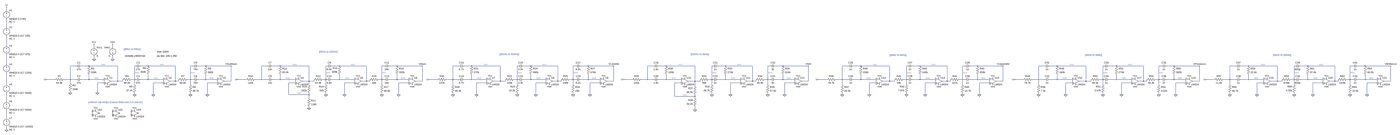
[diagram p0: schematic Combined.asc, whole sheet]
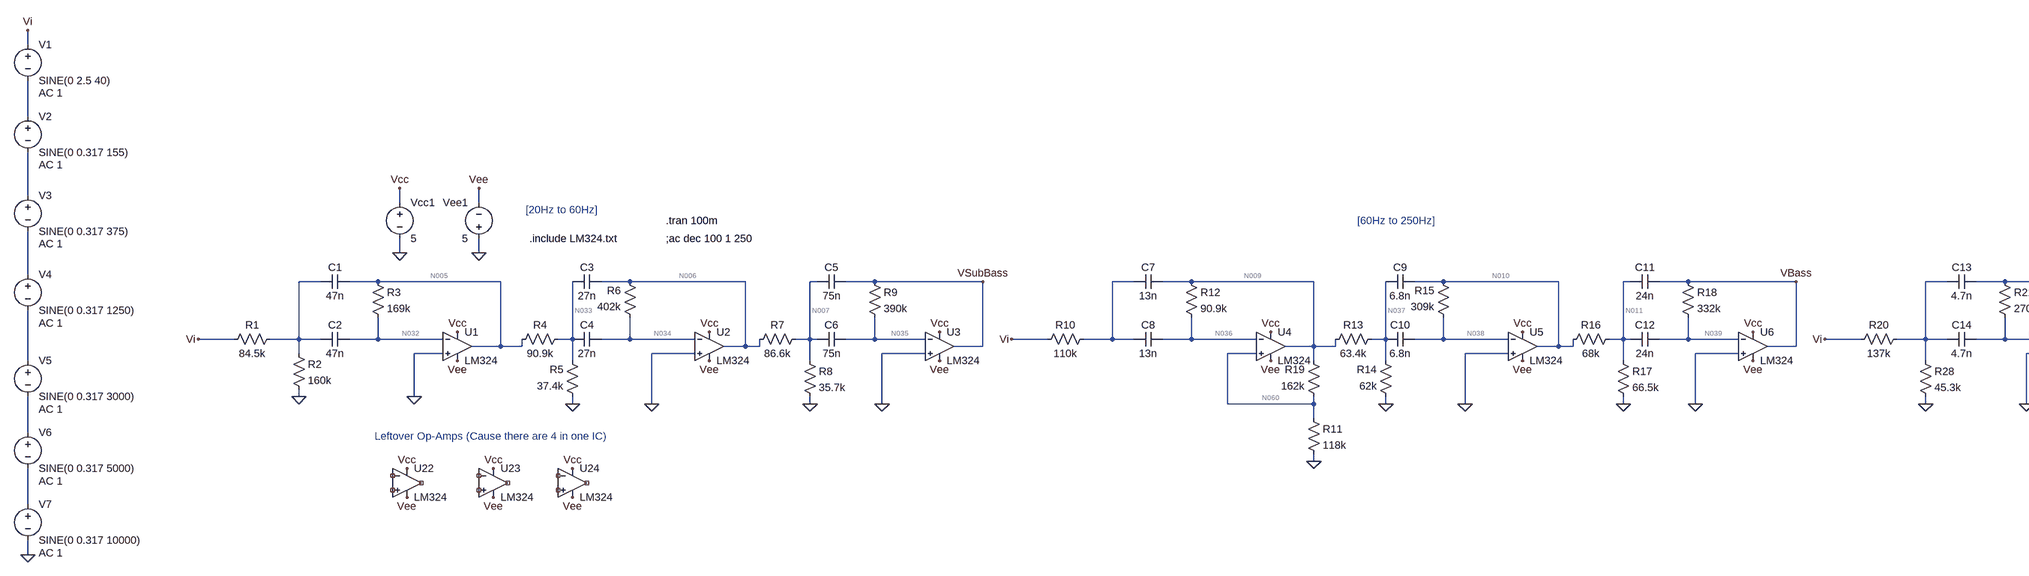
[diagram p1: schematic Combined.asc, part, row 1 of 1, column 1 of 3]
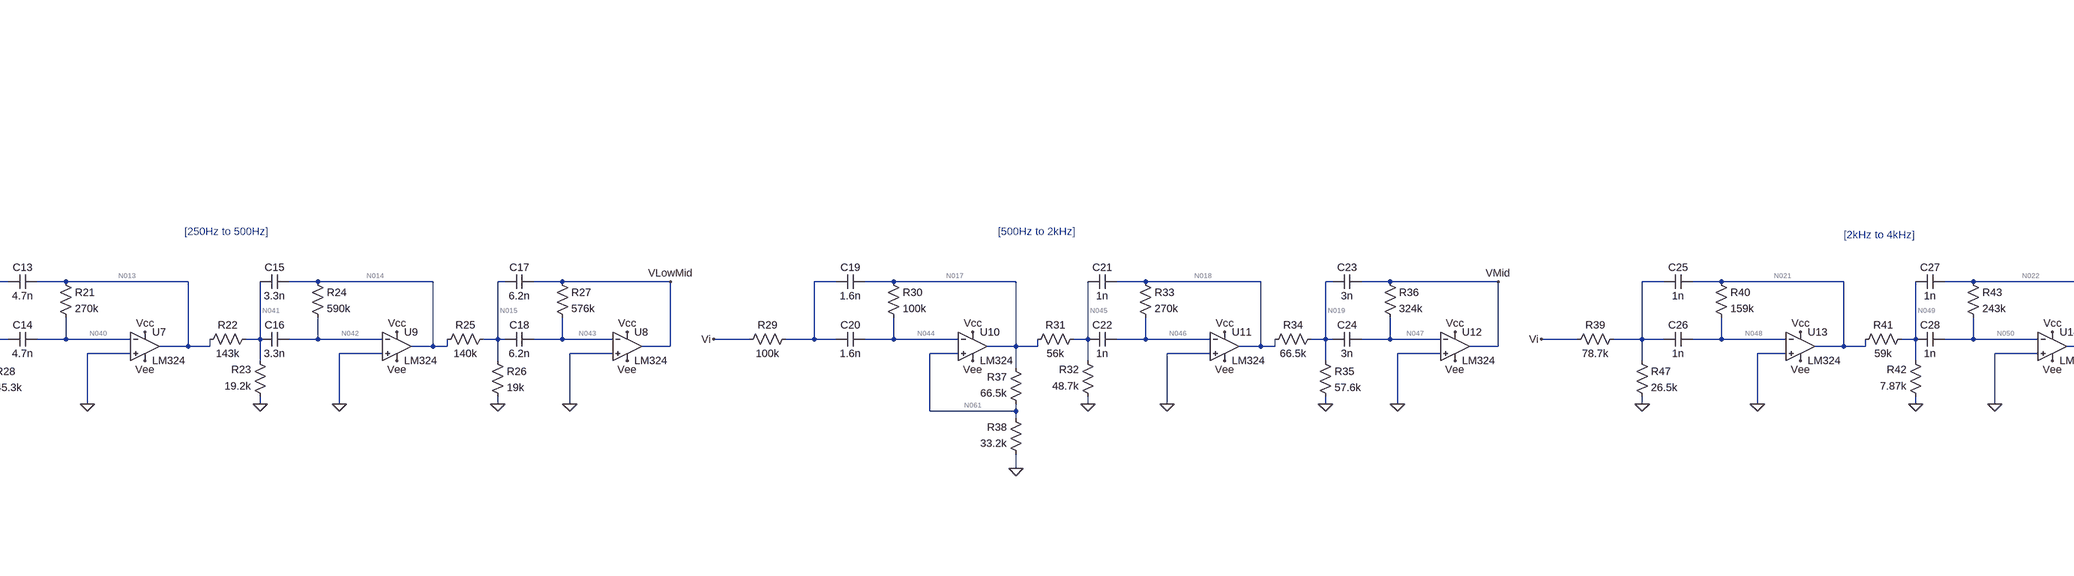
[diagram p2: schematic Combined.asc, part, row 1 of 1, column 2 of 3]
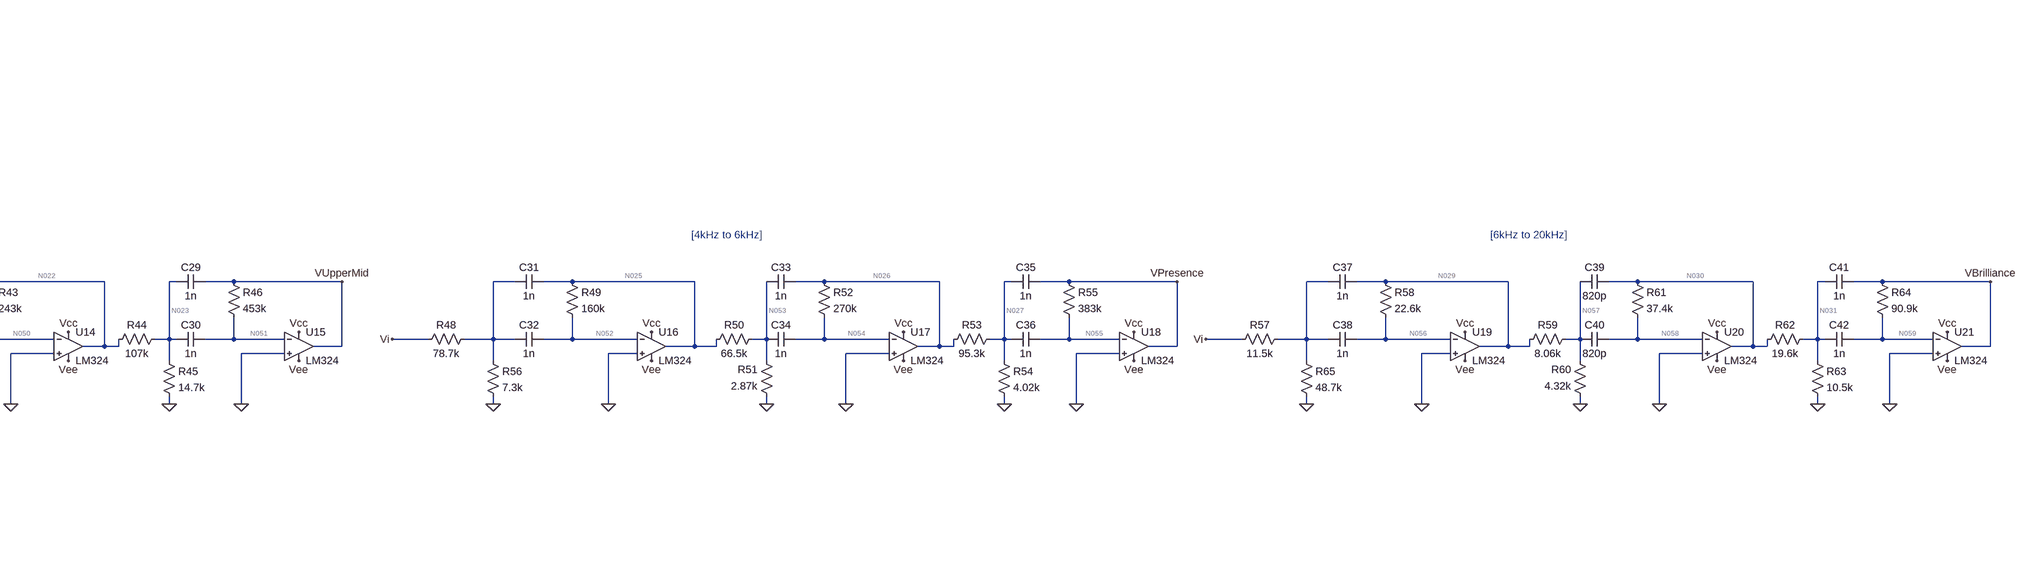
[diagram p3: schematic Combined.asc, part, row 1 of 1, column 3 of 3]
Combined.asc, the LTspice schematic file:
Version 4
SHEET 1 12128 3716
WIRE -1088 -864 -1088 -896
WIRE -1088 -704 -1088 -784
WIRE -1088 -528 -1088 -624
WIRE -208 -512 -208 -544
WIRE -32 -512 -32 -544
WIRE -208 -400 -208 -432
WIRE -32 -400 -32 -432
WIRE -1088 -352 -1088 -448
WIRE -384 -336 -432 -336
WIRE -256 -336 -320 -336
WIRE 16 -336 -256 -336
WIRE 304 -336 240 -336
WIRE 560 -336 304 -336
WIRE 720 -336 704 -336
WIRE 848 -336 784 -336
WIRE 1088 -336 848 -336
WIRE 1424 -336 1376 -336
WIRE 1552 -336 1488 -336
WIRE 1824 -336 1552 -336
WIRE 2112 -336 2048 -336
WIRE 2368 -336 2112 -336
WIRE 2528 -336 2512 -336
WIRE 2656 -336 2592 -336
WIRE 2896 -336 2656 -336
WIRE 3232 -336 3184 -336
WIRE 3360 -336 3296 -336
WIRE 3632 -336 3360 -336
WIRE 3920 -336 3856 -336
WIRE 4176 -336 3920 -336
WIRE 4336 -336 4320 -336
WIRE 4464 -336 4400 -336
WIRE 4704 -336 4464 -336
WIRE 5072 -336 5024 -336
WIRE 5200 -336 5136 -336
WIRE 5472 -336 5200 -336
WIRE 5760 -336 5696 -336
WIRE 6016 -336 5760 -336
WIRE 6176 -336 6160 -336
WIRE 6304 -336 6240 -336
WIRE 6544 -336 6304 -336
WIRE 6912 -336 6864 -336
WIRE 7040 -336 6976 -336
WIRE 7312 -336 7040 -336
WIRE 7600 -336 7536 -336
WIRE 7856 -336 7600 -336
WIRE 8016 -336 8000 -336
WIRE 8144 -336 8080 -336
WIRE 8384 -336 8144 -336
WIRE 8768 -336 8720 -336
WIRE 8896 -336 8832 -336
WIRE 9168 -336 8896 -336
WIRE 9456 -336 9392 -336
WIRE 9712 -336 9456 -336
WIRE 9872 -336 9856 -336
WIRE 10000 -336 9936 -336
WIRE 10240 -336 10000 -336
WIRE 10576 -336 10528 -336
WIRE 10704 -336 10640 -336
WIRE 10976 -336 10704 -336
WIRE 11264 -336 11200 -336
WIRE 11520 -336 11264 -336
WIRE 11680 -336 11664 -336
WIRE 11808 -336 11744 -336
WIRE 12048 -336 11808 -336
WIRE -576 -208 -656 -208
WIRE -432 -208 -432 -336
WIRE -432 -208 -496 -208
WIRE -384 -208 -432 -208
WIRE -256 -208 -256 -256
WIRE -256 -208 -320 -208
WIRE -112 -208 -256 -208
WIRE 176 -208 176 -336
WIRE 176 -208 144 -208
WIRE 304 -208 304 -256
WIRE 304 -208 240 -208
WIRE 448 -208 304 -208
WIRE 704 -208 704 -336
WIRE 704 -208 672 -208
WIRE 720 -208 704 -208
WIRE 848 -208 848 -256
WIRE 848 -208 784 -208
WIRE 960 -208 848 -208
WIRE 1232 -208 1152 -208
WIRE 1376 -208 1376 -336
WIRE 1376 -208 1312 -208
WIRE 1424 -208 1376 -208
WIRE 1552 -208 1552 -256
WIRE 1552 -208 1488 -208
WIRE 1696 -208 1552 -208
WIRE 1984 -208 1984 -336
WIRE 1984 -208 1952 -208
WIRE 2112 -208 2112 -256
WIRE 2112 -208 2048 -208
WIRE 2256 -208 2112 -208
WIRE 2512 -208 2512 -336
WIRE 2512 -208 2480 -208
WIRE 2528 -208 2512 -208
WIRE 2656 -208 2656 -256
WIRE 2656 -208 2592 -208
WIRE 2768 -208 2656 -208
WIRE 3040 -208 2960 -208
WIRE 3184 -208 3184 -336
WIRE 3184 -208 3120 -208
WIRE 3232 -208 3184 -208
WIRE 3360 -208 3360 -256
WIRE 3360 -208 3296 -208
WIRE 3504 -208 3360 -208
WIRE 3792 -208 3792 -336
WIRE 3792 -208 3760 -208
WIRE 3920 -208 3920 -256
WIRE 3920 -208 3856 -208
WIRE 4064 -208 3920 -208
WIRE 4320 -208 4320 -336
WIRE 4320 -208 4288 -208
WIRE 4336 -208 4320 -208
WIRE 4464 -208 4464 -256
WIRE 4464 -208 4400 -208
WIRE 4576 -208 4464 -208
WIRE 4880 -208 4800 -208
WIRE 5024 -208 5024 -336
WIRE 5024 -208 4960 -208
WIRE 5072 -208 5024 -208
WIRE 5200 -208 5200 -256
WIRE 5200 -208 5136 -208
WIRE 5344 -208 5200 -208
WIRE 5632 -208 5632 -336
WIRE 5632 -208 5600 -208
WIRE 5760 -208 5760 -256
WIRE 5760 -208 5696 -208
WIRE 5904 -208 5760 -208
WIRE 6160 -208 6160 -336
WIRE 6160 -208 6128 -208
WIRE 6176 -208 6160 -208
WIRE 6304 -208 6304 -256
WIRE 6304 -208 6240 -208
WIRE 6416 -208 6304 -208
WIRE 6720 -208 6640 -208
WIRE 6864 -208 6864 -336
WIRE 6864 -208 6800 -208
WIRE 6912 -208 6864 -208
WIRE 7040 -208 7040 -256
WIRE 7040 -208 6976 -208
WIRE 7184 -208 7040 -208
WIRE 7472 -208 7472 -336
WIRE 7472 -208 7440 -208
WIRE 7600 -208 7600 -256
WIRE 7600 -208 7536 -208
WIRE 7744 -208 7600 -208
WIRE 8000 -208 8000 -336
WIRE 8000 -208 7968 -208
WIRE 8016 -208 8000 -208
WIRE 8144 -208 8144 -256
WIRE 8144 -208 8080 -208
WIRE 8256 -208 8144 -208
WIRE 8576 -208 8496 -208
WIRE 8720 -208 8720 -336
WIRE 8720 -208 8656 -208
WIRE 8768 -208 8720 -208
WIRE 8896 -208 8896 -256
WIRE 8896 -208 8832 -208
WIRE 9040 -208 8896 -208
WIRE 9328 -208 9328 -336
WIRE 9328 -208 9296 -208
WIRE 9456 -208 9456 -256
WIRE 9456 -208 9392 -208
WIRE 9600 -208 9456 -208
WIRE 9856 -208 9856 -336
WIRE 9856 -208 9824 -208
WIRE 9872 -208 9856 -208
WIRE 10000 -208 10000 -256
WIRE 10000 -208 9936 -208
WIRE 10112 -208 10000 -208
WIRE 10384 -208 10304 -208
WIRE 10528 -208 10528 -336
WIRE 10528 -208 10464 -208
WIRE 10576 -208 10528 -208
WIRE 10704 -208 10704 -256
WIRE 10704 -208 10640 -208
WIRE 10848 -208 10704 -208
WIRE 11136 -208 11136 -336
WIRE 11136 -208 11104 -208
WIRE 11264 -208 11264 -256
WIRE 11264 -208 11200 -208
WIRE 11408 -208 11264 -208
WIRE 11664 -208 11664 -336
WIRE 11664 -208 11632 -208
WIRE 11680 -208 11664 -208
WIRE 11808 -208 11808 -256
WIRE 11808 -208 11744 -208
WIRE 11920 -208 11808 -208
WIRE 16 -192 16 -336
WIRE 16 -192 -48 -192
WIRE 64 -192 64 -208
WIRE 64 -192 16 -192
WIRE 560 -192 560 -336
WIRE 560 -192 512 -192
WIRE 592 -192 592 -208
WIRE 592 -192 560 -192
WIRE 1088 -192 1088 -336
WIRE 1088 -192 1024 -192
WIRE 1824 -192 1824 -336
WIRE 1824 -192 1760 -192
WIRE 1872 -192 1872 -208
WIRE 1872 -192 1824 -192
WIRE 2368 -192 2368 -336
WIRE 2368 -192 2320 -192
WIRE 2400 -192 2400 -208
WIRE 2400 -192 2368 -192
WIRE 2896 -192 2896 -336
WIRE 2896 -192 2832 -192
WIRE 3632 -192 3632 -336
WIRE 3632 -192 3568 -192
WIRE 3680 -192 3680 -208
WIRE 3680 -192 3632 -192
WIRE 4176 -192 4176 -336
WIRE 4176 -192 4128 -192
WIRE 4208 -192 4208 -208
WIRE 4208 -192 4176 -192
WIRE 4704 -192 4704 -336
WIRE 4704 -192 4640 -192
WIRE 5472 -192 5472 -336
WIRE 5472 -192 5408 -192
WIRE 5520 -192 5520 -208
WIRE 5520 -192 5472 -192
WIRE 6016 -192 6016 -336
WIRE 6016 -192 5968 -192
WIRE 6048 -192 6048 -208
WIRE 6048 -192 6016 -192
WIRE 6544 -192 6544 -336
WIRE 6544 -192 6480 -192
WIRE 7312 -192 7312 -336
WIRE 7312 -192 7248 -192
WIRE 7360 -192 7360 -208
WIRE 7360 -192 7312 -192
WIRE 7856 -192 7856 -336
WIRE 7856 -192 7808 -192
WIRE 7888 -192 7888 -208
WIRE 7888 -192 7856 -192
WIRE 8384 -192 8384 -336
WIRE 8384 -192 8320 -192
WIRE 9168 -192 9168 -336
WIRE 9168 -192 9104 -192
WIRE 9216 -192 9216 -208
WIRE 9216 -192 9168 -192
WIRE 9712 -192 9712 -336
WIRE 9712 -192 9664 -192
WIRE 9744 -192 9744 -208
WIRE 9744 -192 9712 -192
WIRE 10240 -192 10240 -336
WIRE 10240 -192 10176 -192
WIRE 10976 -192 10976 -336
WIRE 10976 -192 10912 -192
WIRE 11024 -192 11024 -208
WIRE 11024 -192 10976 -192
WIRE 11520 -192 11520 -336
WIRE 11520 -192 11472 -192
WIRE 11552 -192 11552 -208
WIRE 11552 -192 11520 -192
WIRE 12048 -192 12048 -336
WIRE 12048 -192 11984 -192
WIRE -432 -176 -432 -208
WIRE -112 -176 -176 -176
WIRE 448 -176 352 -176
WIRE 960 -176 864 -176
WIRE 1696 -176 1632 -176
WIRE 2256 -176 2160 -176
WIRE 2768 -176 2672 -176
WIRE 3504 -176 3408 -176
WIRE 4064 -176 3968 -176
WIRE 4576 -176 4480 -176
WIRE 5344 -176 5280 -176
WIRE 5904 -176 5808 -176
WIRE 6416 -176 6320 -176
WIRE 7184 -176 7120 -176
WIRE 7744 -176 7648 -176
WIRE 8256 -176 8160 -176
WIRE 9040 -176 8976 -176
WIRE 9600 -176 9504 -176
WIRE 10112 -176 10016 -176
WIRE 10848 -176 10784 -176
WIRE 11408 -176 11312 -176
WIRE 11920 -176 11824 -176
WIRE -1088 -160 -1088 -272
WIRE 176 -160 176 -208
WIRE 704 -160 704 -208
WIRE 1824 -160 1824 -192
WIRE 1984 -160 1984 -208
WIRE 2512 -160 2512 -208
WIRE 3184 -160 3184 -208
WIRE 3792 -160 3792 -208
WIRE 4320 -160 4320 -208
WIRE 5632 -160 5632 -208
WIRE 6160 -160 6160 -208
WIRE 6864 -160 6864 -208
WIRE 7472 -160 7472 -208
WIRE 8000 -160 8000 -208
WIRE 8720 -160 8720 -208
WIRE 9328 -160 9328 -208
WIRE 9856 -160 9856 -208
WIRE 10528 -160 10528 -208
WIRE 11136 -160 11136 -208
WIRE 11664 -160 11664 -208
WIRE 5472 -144 5472 -192
WIRE -432 -80 -432 -96
WIRE -176 -80 -176 -176
WIRE 176 -64 176 -80
WIRE 352 -64 352 -176
WIRE 704 -64 704 -80
WIRE 864 -64 864 -176
WIRE 1632 -64 1632 -176
WIRE 1824 -64 1824 -80
WIRE 1824 -64 1632 -64
WIRE 1984 -64 1984 -80
WIRE 2160 -64 2160 -176
WIRE 2512 -64 2512 -80
WIRE 2672 -64 2672 -176
WIRE 3184 -64 3184 -80
WIRE 3408 -64 3408 -176
WIRE 3792 -64 3792 -80
WIRE 3968 -64 3968 -176
WIRE 4320 -64 4320 -80
WIRE 4480 -64 4480 -176
WIRE 5632 -64 5632 -80
WIRE 5808 -64 5808 -176
WIRE 6160 -64 6160 -80
WIRE 6320 -64 6320 -176
WIRE 6864 -64 6864 -80
WIRE 7120 -64 7120 -176
WIRE 7472 -64 7472 -80
WIRE 7648 -64 7648 -176
WIRE 8000 -64 8000 -80
WIRE 8160 -64 8160 -176
WIRE 8720 -64 8720 -80
WIRE 8976 -64 8976 -176
WIRE 9328 -64 9328 -80
WIRE 9504 -64 9504 -176
WIRE 9856 -64 9856 -80
WIRE 10016 -64 10016 -176
WIRE 10528 -64 10528 -80
WIRE 10784 -64 10784 -176
WIRE 11136 -64 11136 -80
WIRE 11312 -64 11312 -176
WIRE 11664 -64 11664 -80
WIRE 11824 -64 11824 -176
WIRE 5280 -48 5280 -176
WIRE 5472 -48 5472 -64
WIRE 5472 -48 5280 -48
WIRE 1824 -32 1824 -64
WIRE 5472 -32 5472 -48
WIRE -1088 0 -1088 -80
WIRE 1824 64 1824 48
WIRE 5472 80 5472 48
WIRE -1088 160 -1088 80
WIRE -1088 272 -1088 240
FLAG 352 -64 0
FLAG -1088 -896 Vi
FLAG 864 -64 0
FLAG 704 -64 0
FLAG 176 -64 0
FLAG -432 -80 0
FLAG -176 -80 0
FLAG -80 -160 Vee
FLAG -80 -224 Vcc
FLAG 480 -160 Vee
FLAG 480 -224 Vcc
FLAG 992 -160 Vee
FLAG 992 -224 Vcc
FLAG -208 -544 Vcc
FLAG -208 -400 0
FLAG -32 -400 0
FLAG -32 -544 Vee
FLAG 2160 -64 0
FLAG 1152 -208 Vi
FLAG 2672 -64 0
FLAG 2512 -64 0
FLAG 1984 -64 0
FLAG 1824 64 0
FLAG 1728 -160 Vee
FLAG 1728 -224 Vcc
FLAG 2288 -160 Vee
FLAG 2288 -224 Vcc
FLAG 2800 -160 Vee
FLAG 2800 -224 Vcc
FLAG 3968 -64 0
FLAG 2960 -208 Vi
FLAG 4480 -64 0
FLAG 4320 -64 0
FLAG 3792 -64 0
FLAG 3408 -64 0
FLAG 3184 -64 0
FLAG 3536 -160 Vee
FLAG 3536 -224 Vcc
FLAG 4608 -160 Vee
FLAG 4608 -224 Vcc
FLAG 4096 -160 Vee
FLAG 4096 -224 Vcc
FLAG 5808 -64 0
FLAG 4800 -208 Vi
FLAG 6320 -64 0
FLAG 6160 -64 0
FLAG 5632 -64 0
FLAG 5472 80 0
FLAG 5376 -160 Vee
FLAG 5376 -224 Vcc
FLAG 5936 -160 Vee
FLAG 5936 -224 Vcc
FLAG 6448 -160 Vee
FLAG 6448 -224 Vcc
FLAG 7648 -64 0
FLAG 6640 -208 Vi
FLAG 8160 -64 0
FLAG 8000 -64 0
FLAG 7472 -64 0
FLAG 6864 -64 0
FLAG 7120 -64 0
FLAG 7216 -160 Vee
FLAG 7216 -224 Vcc
FLAG 7776 -160 Vee
FLAG 7776 -224 Vcc
FLAG 8288 -160 Vee
FLAG 8288 -224 Vcc
FLAG 9504 -64 0
FLAG 8496 -208 Vi
FLAG 10016 -64 0
FLAG 9856 -64 0
FLAG 9328 -64 0
FLAG 8720 -64 0
FLAG 8976 -64 0
FLAG 9072 -160 Vee
FLAG 9072 -224 Vcc
FLAG 9632 -160 Vee
FLAG 9632 -224 Vcc
FLAG 10144 -160 Vee
FLAG 10144 -224 Vcc
FLAG 11312 -64 0
FLAG -1088 272 0
FLAG 10304 -208 Vi
FLAG 11824 -64 0
FLAG 11664 -64 0
FLAG 11136 -64 0
FLAG 10528 -64 0
FLAG 10784 -64 0
FLAG 10880 -160 Vee
FLAG 10880 -224 Vcc
FLAG 11440 -160 Vee
FLAG 11440 -224 Vcc
FLAG 11952 -160 Vee
FLAG 11952 -224 Vcc
FLAG -656 -208 Vi
FLAG 1088 -336 VSubBass
FLAG 2896 -336 VBass
FLAG 4704 -336 VLowMid
FLAG 6544 -336 VMid
FLAG 8384 -336 VUpperMid
FLAG 10240 -336 VPresence
FLAG 12048 -336 VBrilliance
FLAG -192 144 Vee
FLAG -192 80 Vcc
FLAG 0 144 Vee
FLAG 0 80 Vcc
FLAG 176 144 Vee
FLAG 176 80 Vcc
SYMBOL res -480 -224 R90
WINDOW 0 0 56 VBottom 2
WINDOW 3 32 56 VTop 2
SYMATTR InstName R1
SYMATTR Value 84.5k
SYMBOL voltage -1088 -880 R0
WINDOW 123 24 124 Left 2
WINDOW 39 0 0 Left 0
SYMATTR Value2 AC 1
SYMATTR InstName V1
SYMATTR Value SINE(0 2.5 40)
SYMBOL res -448 -192 R0
SYMATTR InstName R2
SYMATTR Value 160k
SYMBOL res -272 -352 R0
SYMATTR InstName R3
SYMATTR Value 169k
SYMBOL res 160 -224 R90
WINDOW 0 0 56 VBottom 2
WINDOW 3 32 56 VTop 2
SYMATTR InstName R4
SYMATTR Value 90.9k
SYMBOL res 192 -64 R180
WINDOW 0 36 76 Left 2
WINDOW 3 36 40 Left 2
SYMATTR InstName R5
SYMATTR Value 37.4k
SYMBOL res 320 -240 R180
WINDOW 0 36 76 Left 2
WINDOW 3 36 40 Left 2
SYMATTR InstName R6
SYMATTR Value 402k
SYMBOL res 576 -192 R270
WINDOW 0 32 56 VTop 2
WINDOW 3 0 56 VBottom 2
SYMATTR InstName R7
SYMATTR Value 86.6k
SYMBOL res 688 -176 R0
SYMATTR InstName R8
SYMATTR Value 35.7k
SYMBOL res 832 -352 R0
SYMATTR InstName R9
SYMATTR Value 390k
SYMBOL cap -320 -352 R90
WINDOW 0 0 32 VBottom 2
WINDOW 3 32 32 VTop 2
SYMATTR InstName C1
SYMATTR Value 47n
SYMBOL cap -320 -224 R90
WINDOW 0 0 32 VBottom 2
WINDOW 3 32 32 VTop 2
SYMATTR InstName C2
SYMATTR Value 47n
SYMBOL cap 240 -352 R90
WINDOW 0 0 32 VBottom 2
WINDOW 3 32 32 VTop 2
SYMATTR InstName C3
SYMATTR Value 27n
SYMBOL cap 240 -224 R90
WINDOW 0 0 32 VBottom 2
WINDOW 3 32 32 VTop 2
SYMATTR InstName C4
SYMATTR Value 27n
SYMBOL cap 784 -352 R90
WINDOW 0 0 32 VBottom 2
WINDOW 3 32 32 VTop 2
SYMATTR InstName C5
SYMATTR Value 75n
SYMBOL cap 784 -224 R90
WINDOW 0 0 32 VBottom 2
WINDOW 3 32 32 VTop 2
SYMATTR InstName C6
SYMATTR Value 75n
SYMBOL OpAmps\\opamp2 -80 -256 R0
SYMATTR InstName U1
SYMATTR Value LM324
SYMBOL OpAmps\\opamp2 480 -256 R0
SYMATTR InstName U2
SYMATTR Value LM324
SYMBOL OpAmps\\opamp2 992 -256 R0
SYMATTR InstName U3
SYMATTR Value LM324
SYMBOL voltage -208 -528 R0
WINDOW 123 0 0 Left 0
WINDOW 39 0 0 Left 0
SYMATTR InstName Vcc1
SYMATTR Value 5
SYMBOL voltage -32 -416 R180
WINDOW 0 24 96 Left 2
WINDOW 3 24 16 Left 2
WINDOW 123 0 0 Left 0
WINDOW 39 0 0 Left 0
SYMATTR InstName Vee1
SYMATTR Value 5
SYMBOL res 1328 -224 R90
WINDOW 0 0 56 VBottom 2
WINDOW 3 32 56 VTop 2
SYMATTR InstName R10
SYMATTR Value 110k
SYMBOL voltage -1088 -720 R0
WINDOW 123 24 124 Left 2
WINDOW 39 0 0 Left 0
SYMATTR Value2 AC 1
SYMATTR InstName V2
SYMATTR Value SINE(0 0.317 155)
SYMBOL res 1808 -48 R0
SYMATTR InstName R11
SYMATTR Value 118k
SYMBOL res 1536 -352 R0
SYMATTR InstName R12
SYMATTR Value 90.9k
SYMBOL res 1968 -224 R90
WINDOW 0 0 56 VBottom 2
WINDOW 3 32 56 VTop 2
SYMATTR InstName R13
SYMATTR Value 63.4k
SYMBOL res 2000 -64 R180
WINDOW 0 36 76 Left 2
WINDOW 3 36 40 Left 2
SYMATTR InstName R14
SYMATTR Value 62k
SYMBOL res 2128 -240 R180
WINDOW 0 36 76 Left 2
WINDOW 3 36 40 Left 2
SYMATTR InstName R15
SYMATTR Value 309k
SYMBOL res 2384 -192 R270
WINDOW 0 32 56 VTop 2
WINDOW 3 0 56 VBottom 2
SYMATTR InstName R16
SYMATTR Value 68k
SYMBOL res 2496 -176 R0
SYMATTR InstName R17
SYMATTR Value 66.5k
SYMBOL res 2640 -352 R0
SYMATTR InstName R18
SYMATTR Value 332k
SYMBOL cap 1488 -352 R90
WINDOW 0 0 32 VBottom 2
WINDOW 3 32 32 VTop 2
SYMATTR InstName C7
SYMATTR Value 13n
SYMBOL cap 1488 -224 R90
WINDOW 0 0 32 VBottom 2
WINDOW 3 32 32 VTop 2
SYMATTR InstName C8
SYMATTR Value 13n
SYMBOL cap 2048 -352 R90
WINDOW 0 0 32 VBottom 2
WINDOW 3 32 32 VTop 2
SYMATTR InstName C9
SYMATTR Value 6.8n
SYMBOL cap 2048 -224 R90
WINDOW 0 0 32 VBottom 2
WINDOW 3 32 32 VTop 2
SYMATTR InstName C10
SYMATTR Value 6.8n
SYMBOL cap 2592 -352 R90
WINDOW 0 0 32 VBottom 2
WINDOW 3 32 32 VTop 2
SYMATTR InstName C11
SYMATTR Value 24n
SYMBOL cap 2592 -224 R90
WINDOW 0 0 32 VBottom 2
WINDOW 3 32 32 VTop 2
SYMATTR InstName C12
SYMATTR Value 24n
SYMBOL res 1840 -64 R180
WINDOW 0 36 76 Left 2
WINDOW 3 36 40 Left 2
SYMATTR InstName R19
SYMATTR Value 162k
SYMBOL OpAmps\\opamp2 1728 -256 R0
SYMATTR InstName U4
SYMATTR Value LM324
SYMBOL OpAmps\\opamp2 2288 -256 R0
SYMATTR InstName U5
SYMATTR Value LM324
SYMBOL OpAmps\\opamp2 2800 -256 R0
SYMATTR InstName U6
SYMATTR Value LM324
SYMBOL res 3136 -224 R90
WINDOW 0 0 56 VBottom 2
WINDOW 3 32 56 VTop 2
SYMATTR InstName R20
SYMATTR Value 137k
SYMBOL voltage -1088 -544 R0
WINDOW 123 24 124 Left 2
WINDOW 39 0 0 Left 0
SYMATTR Value2 AC 1
SYMATTR InstName V3
SYMATTR Value SINE(0 0.317 375)
SYMBOL res 3344 -352 R0
SYMATTR InstName R21
SYMATTR Value 270k
SYMBOL res 3776 -224 R90
WINDOW 0 0 56 VBottom 2
WINDOW 3 32 56 VTop 2
SYMATTR InstName R22
SYMATTR Value 143k
SYMBOL res 3808 -64 R180
WINDOW 0 36 76 Left 2
WINDOW 3 36 40 Left 2
SYMATTR InstName R23
SYMATTR Value 19.2k
SYMBOL res 3904 -352 R0
SYMATTR InstName R24
SYMATTR Value 590k
SYMBOL res 4192 -192 R270
WINDOW 0 32 56 VTop 2
WINDOW 3 0 56 VBottom 2
SYMATTR InstName R25
SYMATTR Value 140k
SYMBOL res 4304 -176 R0
SYMATTR InstName R26
SYMATTR Value 19k
SYMBOL res 4448 -352 R0
SYMATTR InstName R27
SYMATTR Value 576k
SYMBOL cap 3296 -352 R90
WINDOW 0 0 32 VBottom 2
WINDOW 3 32 32 VTop 2
SYMATTR InstName C13
SYMATTR Value 4.7n
SYMBOL cap 3296 -224 R90
WINDOW 0 0 32 VBottom 2
WINDOW 3 32 32 VTop 2
SYMATTR InstName C14
SYMATTR Value 4.7n
SYMBOL cap 3856 -352 R90
WINDOW 0 0 32 VBottom 2
WINDOW 3 32 32 VTop 2
SYMATTR InstName C15
SYMATTR Value 3.3n
SYMBOL cap 3856 -224 R90
WINDOW 0 0 32 VBottom 2
WINDOW 3 32 32 VTop 2
SYMATTR InstName C16
SYMATTR Value 3.3n
SYMBOL cap 4400 -352 R90
WINDOW 0 0 32 VBottom 2
WINDOW 3 32 32 VTop 2
SYMATTR InstName C17
SYMATTR Value 6.2n
SYMBOL cap 4400 -224 R90
WINDOW 0 0 32 VBottom 2
WINDOW 3 32 32 VTop 2
SYMATTR InstName C18
SYMATTR Value 6.2n
SYMBOL res 3168 -176 R0
SYMATTR InstName R28
SYMATTR Value 45.3k
SYMBOL OpAmps\\opamp2 3536 -256 R0
SYMATTR InstName U7
SYMATTR Value LM324
SYMBOL OpAmps\\opamp2 4608 -256 R0
SYMATTR InstName U8
SYMATTR Value LM324
SYMBOL OpAmps\\opamp2 4096 -256 R0
SYMATTR InstName U9
SYMATTR Value LM324
SYMBOL res 4976 -224 R90
WINDOW 0 0 56 VBottom 2
WINDOW 3 32 56 VTop 2
SYMATTR InstName R29
SYMATTR Value 100k
SYMBOL voltage -1088 -368 R0
WINDOW 123 24 124 Left 2
WINDOW 39 0 0 Left 0
SYMATTR Value2 AC 1
SYMATTR InstName V4
SYMATTR Value SINE(0 0.317 1250)
SYMBOL res 5184 -352 R0
SYMATTR InstName R30
SYMATTR Value 100k
SYMBOL res 5616 -224 R90
WINDOW 0 0 56 VBottom 2
WINDOW 3 32 56 VTop 2
SYMATTR InstName R31
SYMATTR Value 56k
SYMBOL res 5648 -64 R180
WINDOW 0 36 76 Left 2
WINDOW 3 36 40 Left 2
SYMATTR InstName R32
SYMATTR Value 48.7k
SYMBOL res 5744 -352 R0
SYMATTR InstName R33
SYMATTR Value 270k
SYMBOL res 6032 -192 R270
WINDOW 0 32 56 VTop 2
WINDOW 3 0 56 VBottom 2
SYMATTR InstName R34
SYMATTR Value 66.5k
SYMBOL res 6144 -176 R0
SYMATTR InstName R35
SYMATTR Value 57.6k
SYMBOL res 6288 -352 R0
SYMATTR InstName R36
SYMATTR Value 324k
SYMBOL cap 5136 -352 R90
WINDOW 0 0 32 VBottom 2
WINDOW 3 32 32 VTop 2
SYMATTR InstName C19
SYMATTR Value 1.6n
SYMBOL cap 5136 -224 R90
WINDOW 0 0 32 VBottom 2
WINDOW 3 32 32 VTop 2
SYMATTR InstName C20
SYMATTR Value 1.6n
SYMBOL cap 5696 -352 R90
WINDOW 0 0 32 VBottom 2
WINDOW 3 32 32 VTop 2
SYMATTR InstName C21
SYMATTR Value 1n
SYMBOL cap 5696 -224 R90
WINDOW 0 0 32 VBottom 2
WINDOW 3 32 32 VTop 2
SYMATTR InstName C22
SYMATTR Value 1n
SYMBOL cap 6240 -352 R90
WINDOW 0 0 32 VBottom 2
WINDOW 3 32 32 VTop 2
SYMATTR InstName C23
SYMATTR Value 3n
SYMBOL cap 6240 -224 R90
WINDOW 0 0 32 VBottom 2
WINDOW 3 32 32 VTop 2
SYMATTR InstName C24
SYMATTR Value 3n
SYMBOL res 5488 -48 R180
WINDOW 0 36 76 Left 2
WINDOW 3 36 40 Left 2
SYMATTR InstName R37
SYMATTR Value 66.5k
SYMBOL res 5488 64 R180
WINDOW 0 36 76 Left 2
WINDOW 3 36 40 Left 2
SYMATTR InstName R38
SYMATTR Value 33.2k
SYMBOL OpAmps\\opamp2 5376 -256 R0
SYMATTR InstName U10
SYMATTR Value LM324
SYMBOL OpAmps\\opamp2 5936 -256 R0
SYMATTR InstName U11
SYMATTR Value LM324
SYMBOL OpAmps\\opamp2 6448 -256 R0
SYMATTR InstName U12
SYMATTR Value LM324
SYMBOL res 6816 -224 R90
WINDOW 0 0 56 VBottom 2
WINDOW 3 32 56 VTop 2
SYMATTR InstName R39
SYMATTR Value 78.7k
SYMBOL voltage -1088 -176 R0
WINDOW 123 24 124 Left 2
WINDOW 39 0 0 Left 0
SYMATTR Value2 AC 1
SYMATTR InstName V5
SYMATTR Value SINE(0 0.317 3000)
SYMBOL res 7024 -352 R0
SYMATTR InstName R40
SYMATTR Value 159k
SYMBOL res 7456 -224 R90
WINDOW 0 0 56 VBottom 2
WINDOW 3 32 56 VTop 2
SYMATTR InstName R41
SYMATTR Value 59k
SYMBOL res 7488 -64 R180
WINDOW 0 36 76 Left 2
WINDOW 3 36 40 Left 2
SYMATTR InstName R42
SYMATTR Value 7.87k
SYMBOL res 7584 -352 R0
SYMATTR InstName R43
SYMATTR Value 243k
SYMBOL res 7872 -192 R270
WINDOW 0 32 56 VTop 2
WINDOW 3 0 56 VBottom 2
SYMATTR InstName R44
SYMATTR Value 107k
SYMBOL res 7984 -176 R0
SYMATTR InstName R45
SYMATTR Value 14.7k
SYMBOL res 8128 -352 R0
SYMATTR InstName R46
SYMATTR Value 453k
SYMBOL cap 6976 -352 R90
WINDOW 0 0 32 VBottom 2
WINDOW 3 32 32 VTop 2
SYMATTR InstName C25
SYMATTR Value 1n
SYMBOL cap 6976 -224 R90
WINDOW 0 0 32 VBottom 2
WINDOW 3 32 32 VTop 2
SYMATTR InstName C26
SYMATTR Value 1n
SYMBOL cap 7536 -352 R90
WINDOW 0 0 32 VBottom 2
WINDOW 3 32 32 VTop 2
SYMATTR InstName C27
SYMATTR Value 1n
SYMBOL cap 7536 -224 R90
WINDOW 0 0 32 VBottom 2
WINDOW 3 32 32 VTop 2
SYMATTR InstName C28
SYMATTR Value 1n
SYMBOL cap 8080 -352 R90
WINDOW 0 0 32 VBottom 2
WINDOW 3 32 32 VTop 2
SYMATTR InstName C29
SYMATTR Value 1n
SYMBOL cap 8080 -224 R90
WINDOW 0 0 32 VBottom 2
WINDOW 3 32 32 VTop 2
SYMATTR InstName C30
SYMATTR Value 1n
SYMBOL res 6848 -176 R0
SYMATTR InstName R47
SYMATTR Value 26.5k
SYMBOL OpAmps\\opamp2 7216 -256 R0
SYMATTR InstName U13
SYMATTR Value LM324
SYMBOL OpAmps\\opamp2 7776 -256 R0
SYMATTR InstName U14
SYMATTR Value LM324
SYMBOL OpAmps\\opamp2 8288 -256 R0
SYMATTR InstName U15
SYMATTR Value LM324
SYMBOL res 8672 -224 R90
WINDOW 0 0 56 VBottom 2
WINDOW 3 32 56 VTop 2
SYMATTR InstName R48
SYMATTR Value 78.7k
SYMBOL voltage -1088 -16 R0
WINDOW 123 24 124 Left 2
WINDOW 39 0 0 Left 0
SYMATTR Value2 AC 1
SYMATTR InstName V6
SYMATTR Value SINE(0 0.317 5000)
SYMBOL res 8880 -352 R0
SYMATTR InstName R49
SYMATTR Value 160k
SYMBOL res 9312 -224 R90
WINDOW 0 0 56 VBottom 2
WINDOW 3 32 56 VTop 2
SYMATTR InstName R50
SYMATTR Value 66.5k
SYMBOL res 9344 -64 R180
WINDOW 0 36 76 Left 2
WINDOW 3 36 40 Left 2
SYMATTR InstName R51
SYMATTR Value 2.87k
SYMBOL res 9440 -352 R0
SYMATTR InstName R52
SYMATTR Value 270k
SYMBOL res 9728 -192 R270
WINDOW 0 32 56 VTop 2
WINDOW 3 0 56 VBottom 2
SYMATTR InstName R53
SYMATTR Value 95.3k
SYMBOL res 9840 -176 R0
SYMATTR InstName R54
SYMATTR Value 4.02k
SYMBOL res 9984 -352 R0
SYMATTR InstName R55
SYMATTR Value 383k
SYMBOL cap 8832 -352 R90
WINDOW 0 0 32 VBottom 2
WINDOW 3 32 32 VTop 2
SYMATTR InstName C31
SYMATTR Value 1n
SYMBOL cap 8832 -224 R90
WINDOW 0 0 32 VBottom 2
WINDOW 3 32 32 VTop 2
SYMATTR InstName C32
SYMATTR Value 1n
SYMBOL cap 9392 -352 R90
WINDOW 0 0 32 VBottom 2
WINDOW 3 32 32 VTop 2
SYMATTR InstName C33
SYMATTR Value 1n
SYMBOL cap 9392 -224 R90
WINDOW 0 0 32 VBottom 2
WINDOW 3 32 32 VTop 2
SYMATTR InstName C34
SYMATTR Value 1n
SYMBOL cap 9936 -352 R90
WINDOW 0 0 32 VBottom 2
WINDOW 3 32 32 VTop 2
SYMATTR InstName C35
SYMATTR Value 1n
SYMBOL cap 9936 -224 R90
WINDOW 0 0 32 VBottom 2
WINDOW 3 32 32 VTop 2
SYMATTR InstName C36
SYMATTR Value 1n
SYMBOL res 8704 -176 R0
SYMATTR InstName R56
SYMATTR Value 7.3k
SYMBOL OpAmps\\opamp2 9072 -256 R0
SYMATTR InstName U16
SYMATTR Value LM324
SYMBOL OpAmps\\opamp2 9632 -256 R0
SYMATTR InstName U17
SYMATTR Value LM324
SYMBOL OpAmps\\opamp2 10144 -256 R0
SYMATTR InstName U18
SYMATTR Value LM324
SYMBOL res 10480 -224 R90
WINDOW 0 0 56 VBottom 2
WINDOW 3 32 56 VTop 2
SYMATTR InstName R57
SYMATTR Value 11.5k
SYMBOL voltage -1088 144 R0
WINDOW 123 24 124 Left 2
WINDOW 39 0 0 Left 0
SYMATTR Value2 AC 1
SYMATTR InstName V7
SYMATTR Value SINE(0 0.317 10000)
SYMBOL res 10688 -352 R0
SYMATTR InstName R58
SYMATTR Value 22.6k
SYMBOL res 11120 -224 R90
WINDOW 0 0 56 VBottom 2
WINDOW 3 32 56 VTop 2
SYMATTR InstName R59
SYMATTR Value 8.06k
SYMBOL res 11152 -64 R180
WINDOW 0 36 76 Left 2
WINDOW 3 36 40 Left 2
SYMATTR InstName R60
SYMATTR Value 4.32k
SYMBOL res 11248 -352 R0
SYMATTR InstName R61
SYMATTR Value 37.4k
SYMBOL res 11536 -192 R270
WINDOW 0 32 56 VTop 2
WINDOW 3 0 56 VBottom 2
SYMATTR InstName R62
SYMATTR Value 19.6k
SYMBOL res 11648 -176 R0
SYMATTR InstName R63
SYMATTR Value 10.5k
SYMBOL res 11792 -352 R0
SYMATTR InstName R64
SYMATTR Value 90.9k
SYMBOL cap 10640 -352 R90
WINDOW 0 0 32 VBottom 2
WINDOW 3 32 32 VTop 2
SYMATTR InstName C37
SYMATTR Value 1n
SYMBOL cap 10640 -224 R90
WINDOW 0 0 32 VBottom 2
WINDOW 3 32 32 VTop 2
SYMATTR InstName C38
SYMATTR Value 1n
SYMBOL cap 11200 -352 R90
WINDOW 0 0 32 VBottom 2
WINDOW 3 32 32 VTop 2
SYMATTR InstName C39
SYMATTR Value 820p
SYMBOL cap 11200 -224 R90
WINDOW 0 0 32 VBottom 2
WINDOW 3 32 32 VTop 2
SYMATTR InstName C40
SYMATTR Value 820p
SYMBOL cap 11744 -352 R90
WINDOW 0 0 32 VBottom 2
WINDOW 3 32 32 VTop 2
SYMATTR InstName C41
SYMATTR Value 1n
SYMBOL cap 11744 -224 R90
WINDOW 0 0 32 VBottom 2
WINDOW 3 32 32 VTop 2
SYMATTR InstName C42
SYMATTR Value 1n
SYMBOL res 10512 -176 R0
SYMATTR InstName R65
SYMATTR Value 48.7k
SYMBOL OpAmps\\opamp2 10880 -256 R0
SYMATTR InstName U19
SYMATTR Value LM324
SYMBOL OpAmps\\opamp2 11440 -256 R0
SYMATTR InstName U20
SYMATTR Value LM324
SYMBOL OpAmps\\opamp2 11952 -256 R0
SYMATTR InstName U21
SYMATTR Value LM324
SYMBOL OpAmps\\opamp2 -192 48 R0
SYMATTR InstName U22
SYMATTR Value LM324
SYMBOL OpAmps\\opamp2 0 48 R0
SYMATTR InstName U23
SYMATTR Value LM324
SYMBOL OpAmps\\opamp2 176 48 R0
SYMATTR InstName U24
SYMATTR Value LM324
TEXT 384 -472 Left 2 !.tran 100m
TEXT 384 -432 Left 2 !;ac dec 100 1 250
TEXT 72 -496 Left 2 ;[20Hz to 60Hz]
TEXT 80 -432 Left 2 !.include LM324.txt
TEXT 1920 -472 Left 2 ;[60Hz to 250Hz]
TEXT 3624 -448 Left 2 ;[250Hz to 500Hz]
TEXT 5432 -448 Left 2 ;[500Hz to 2kHz]
TEXT 7312 -440 Left 2 ;[2kHz to 4kHz]
TEXT 9160 -440 Left 2 ;[4kHz to 6kHz]
TEXT 10936 -440 Left 2 ;[6kHz to 20kHz]
TEXT -264 8 Left 2 ;Leftover Op-Amps (Cause there are 4 in one IC)

The netlist it stands for:
* Combined.asc
R1 N004 Vi 84.5k
V1 Vi N001 SINE(0 2.5 40) AC 1
R2 N004 0 160k
R3 N005 N032 169k
R4 N033 N005 90.9k
R5 0 N033 37.4k
R6 N034 N006 402k
R7 N006 N007 86.6k
R8 N007 0 35.7k
R9 VSubBass N035 390k
C1 N005 N004 47n
C2 N032 N004 47n
C3 N006 N033 27n
C4 N034 N033 27n
C5 VSubBass N007 75n
C6 N035 N007 75n
XU1 0 N032 Vcc Vee N005 LM324  ; pins In+ In- V+ V- OUT
XU2 0 N034 Vcc Vee N006 LM324  ; pins In+ In- V+ V- OUT
XU3 0 N035 Vcc Vee VSubBass LM324  ; pins In+ In- V+ V- OUT
Vcc1 Vcc 0 5
Vee1 0 Vee 5
R10 N008 Vi 110k
V2 N001 N002 SINE(0 0.317 155) AC 1
R11 N060 0 118k
R12 N009 N036 90.9k
R13 N037 N009 63.4k
R14 0 N037 62k
R15 N038 N010 309k
R16 N010 N011 68k
R17 N011 0 66.5k
R18 VBass N039 332k
C7 N009 N008 13n
C8 N036 N008 13n
C9 N010 N037 6.8n
C10 N038 N037 6.8n
C11 VBass N011 24n
C12 N039 N011 24n
R19 N060 N009 162k
XU4 N060 N036 Vcc Vee N009 LM324  ; pins In+ In- V+ V- OUT
XU5 0 N038 Vcc Vee N010 LM324  ; pins In+ In- V+ V- OUT
XU6 0 N039 Vcc Vee VBass LM324  ; pins In+ In- V+ V- OUT
R20 N012 Vi 137k
V3 N002 N003 SINE(0 0.317 375) AC 1
R21 N013 N040 270k
R22 N041 N013 143k
R23 0 N041 19.2k
R24 N014 N042 590k
R25 N014 N015 140k
R26 N015 0 19k
R27 VLowMid N043 576k
C13 N013 N012 4.7n
C14 N040 N012 4.7n
C15 N014 N041 3.3n
C16 N042 N041 3.3n
C17 VLowMid N015 6.2n
C18 N043 N015 6.2n
R28 N012 0 45.3k
XU7 0 N040 Vcc Vee N013 LM324  ; pins In+ In- V+ V- OUT
XU8 0 N043 Vcc Vee VLowMid LM324  ; pins In+ In- V+ V- OUT
XU9 0 N042 Vcc Vee N014 LM324  ; pins In+ In- V+ V- OUT
R29 N016 Vi 100k
V4 N003 N062 SINE(0 0.317 1250) AC 1
R30 N017 N044 100k
R31 N045 N017 56k
R32 0 N045 48.7k
R33 N018 N046 270k
R34 N018 N019 66.5k
R35 N019 0 57.6k
R36 VMid N047 324k
C19 N017 N016 1.6n
C20 N044 N016 1.6n
C21 N018 N045 1n
C22 N046 N045 1n
C23 VMid N019 3n
C24 N047 N019 3n
R37 N061 N017 66.5k
R38 0 N061 33.2k
XU10 N061 N044 Vcc Vee N017 LM324  ; pins In+ In- V+ V- OUT
XU11 0 N046 Vcc Vee N018 LM324  ; pins In+ In- V+ V- OUT
XU12 0 N047 Vcc Vee VMid LM324  ; pins In+ In- V+ V- OUT
R39 N020 Vi 78.7k
V5 N062 N063 SINE(0 0.317 3000) AC 1
R40 N021 N048 159k
R41 N049 N021 59k
R42 0 N049 7.87k
R43 N022 N050 243k
R44 N022 N023 107k
R45 N023 0 14.7k
R46 VUpperMid N051 453k
C25 N021 N020 1n
C26 N048 N020 1n
C27 N022 N049 1n
C28 N050 N049 1n
C29 VUpperMid N023 1n
C30 N051 N023 1n
R47 N020 0 26.5k
XU13 0 N048 Vcc Vee N021 LM324  ; pins In+ In- V+ V- OUT
XU14 0 N050 Vcc Vee N022 LM324  ; pins In+ In- V+ V- OUT
XU15 0 N051 Vcc Vee VUpperMid LM324  ; pins In+ In- V+ V- OUT
R48 N024 Vi 78.7k
V6 N063 N064 SINE(0 0.317 5000) AC 1
R49 N025 N052 160k
R50 N053 N025 66.5k
R51 0 N053 2.87k
R52 N026 N054 270k
R53 N026 N027 95.3k
R54 N027 0 4.02k
R55 VPresence N055 383k
C31 N025 N024 1n
C32 N052 N024 1n
C33 N026 N053 1n
C34 N054 N053 1n
C35 VPresence N027 1n
C36 N055 N027 1n
R56 N024 0 7.3k
XU16 0 N052 Vcc Vee N025 LM324  ; pins In+ In- V+ V- OUT
XU17 0 N054 Vcc Vee N026 LM324  ; pins In+ In- V+ V- OUT
XU18 0 N055 Vcc Vee VPresence LM324  ; pins In+ In- V+ V- OUT
R57 N028 Vi 11.5k
V7 N064 0 SINE(0 0.317 10000) AC 1
R58 N029 N056 22.6k
R59 N057 N029 8.06k
R60 0 N057 4.32k
R61 N030 N058 37.4k
R62 N030 N031 19.6k
R63 N031 0 10.5k
R64 VBrilliance N059 90.9k
C37 N029 N028 1n
C38 N056 N028 1n
C39 N030 N057 820p
C40 N058 N057 820p
C41 VBrilliance N031 1n
C42 N059 N031 1n
R65 N028 0 48.7k
XU19 0 N056 Vcc Vee N029 LM324  ; pins In+ In- V+ V- OUT
XU20 0 N058 Vcc Vee N030 LM324  ; pins In+ In- V+ V- OUT
XU21 0 N059 Vcc Vee VBrilliance LM324  ; pins In+ In- V+ V- OUT
XU22 NC_01 NC_02 Vcc Vee NC_03 LM324  ; pins In+ In- V+ V- OUT
XU23 NC_04 NC_05 Vcc Vee NC_06 LM324  ; pins In+ In- V+ V- OUT
XU24 NC_07 NC_08 Vcc Vee NC_09 LM324  ; pins In+ In- V+ V- OUT
.tran 100m
;ac dec 100 1 250
* [20Hz to 60Hz]
.include LM324.txt
* [60Hz to 250Hz]
* [250Hz to 500Hz]
* [500Hz to 2kHz]
* [2kHz to 4kHz]
* [4kHz to 6kHz]
* [6kHz to 20kHz]
* Leftover Op-Amps (Cause there are 4 in one IC)
.backanno
.end

* Results of the author's LTspice run, read from the files saved beside the schematic
* Operating Point, zero values left out:
*   V(n005) = -3.404 mV
*   V(n032) = -33.62 µV
*   V(n033) = -992.3 µV
*   V(n034) = -33.57 µV
*   V(n006) = -8.051 mV
*   V(n007) = -2.35 mV
*   V(vsubbass) = -7.812 mV
*   V(n035) = -33.58 µV
*   V(vee) = -5 V
*   V(vcc) = 5 V
*   V(n060) = 1.006 mV
*   V(n009) = -840.3 µV
*   V(n036) = 972.6 µV
*   V(n037) = -415.5 µV
*   V(n038) = -33.59 µV
*   V(n010) = -6.196 mV
*   V(n011) = -3.064 mV
*   V(vbass) = -6.655 mV
*   V(n039) = -33.59 µV
*   V(n013) = -5.419 mV
*   V(n040) = -33.6 µV
*   V(n041) = -641.4 µV
*   V(n014) = -11.8 mV
*   V(n042) = -33.54 µV
*   V(n015) = -1.41 mV
*   V(vlowmid) = -11.52 mV
*   V(n043) = -33.54 µV
*   V(n017) = -2.379 mV
*   V(n044) = -384.5 µV
*   V(n045) = -1.107 mV
*   V(n018) = -5.419 mV
*   V(n046) = -33.6 µV
*   V(n019) = -2.515 mV
*   V(vmid) = -6.496 mV
*   V(n047) = -33.59 µV
*   V(n061) = -350.9 µV
*   V(n021) = -3.205 mV
*   V(n048) = -33.62 µV
*   V(n049) = -377.2 µV
*   V(n022) = -4.88 mV
*   V(n050) = -33.61 µV
*   V(n023) = -589.5 µV
*   V(vuppermid) = -9.068 mV
*   V(n051) = -33.56 µV
*   V(n025) = -3.225 mV
*   V(n052) = -33.62 µV
*   V(n053) = -133.4 µV
*   V(n026) = -5.419 mV
*   V(n054) = -33.6 µV
*   V(n027) = -219.3 µV
*   V(vpresence) = -7.672 mV
*   V(n055) = -33.58 µV
*   V(n029) = -484.4 µV
*   V(n056) = -33.65 µV
*   V(n057) = -169 µV
*   V(n030) = -779.6 µV
*   V(n058) = -33.65 µV
*   V(n031) = -271.9 µV
*   V(vbrilliance) = -1.847 mV
*   V(n059) = -33.64 µV
*   I(R64) = -19.94 nA
*   I(R63) = -25.9 nA
*   I(R62) = -25.9 nA
*   I(R61) = -19.94 nA
*   I(R60) = 39.13 nA
*   I(R59) = 39.13 nA
*   I(R58) = -19.94 nA
*   I(R55) = -19.94 nA
*   I(R54) = -54.56 nA
*   I(R53) = -54.56 nA
*   I(R52) = -19.94 nA
*   I(R51) = 46.49 nA
*   I(R50) = 46.49 nA
*   I(R49) = -19.94 nA
*   I(R46) = -19.94 nA
*   I(R45) = -40.1 nA
*   I(R44) = -40.1 nA
*   I(R43) = -19.94 nA
*   I(R42) = 47.93 nA
*   I(R41) = 47.93 nA
*   I(R40) = -19.94 nA
*   I(R38) = 10.57 nA
*   I(R37) = 30.5 nA
*   I(R36) = -19.94 nA
*   I(R35) = -43.66 nA
*   I(R34) = -43.66 nA
*   I(R33) = -19.94 nA
*   I(R32) = 22.72 nA
*   I(R31) = 22.72 nA
*   I(R30) = -19.94 nA
*   I(R27) = -19.94 nA
*   I(R26) = -74.22 nA
*   I(R25) = -74.22 nA
*   I(R24) = -19.94 nA
*   I(R23) = 33.41 nA
*   I(R22) = 33.41 nA
*   I(R21) = -19.94 nA
*   I(R19) = 11.4 nA
*   I(R18) = -19.94 nA
*   I(R17) = -46.07 nA
*   I(R16) = -46.07 nA
*   I(R15) = 19.94 nA
*   I(R14) = 6.701 nA
*   I(R13) = 6.701 nA
*   I(R12) = -19.94 nA
*   I(R11) = 8.528 nA
*   I(R9) = -19.94 nA
*   I(R8) = -65.83 nA
*   I(R7) = -65.83 nA
*   I(R6) = 19.94 nA
*   I(R5) = 26.53 nA
*   I(R4) = 26.53 nA
*   I(R3) = -19.94 nA
*   I(Vee1) = -8.125 mA
*   I(Vcc1) = -8.159 mA